# Altium schematic sheet Processor-2.SchDoc
size A3; Organization: Altium Limited; Address1: L3, 12a Rodborough Rd; Address2: Frenchs Forest; Address3: NSW; Address4: Australia 2086
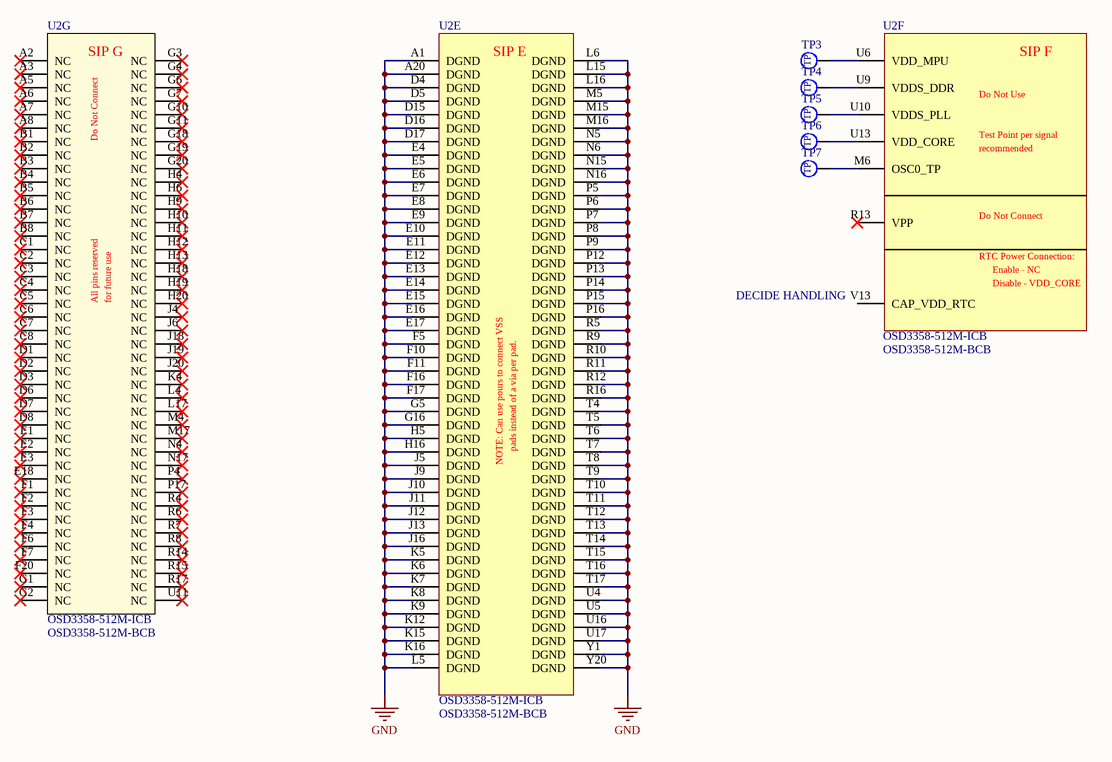
[diagram p0: Processor-2.SchDoc]

## Parts
TP3  2.5mm_SMD_TestPoint  [2.5mm TestPoint]  (value not drawn)
TP4  2.5mm_SMD_TestPoint  [2.5mm TestPoint]  (value not drawn)
TP5  2.5mm_SMD_TestPoint  [2.5mm TestPoint]  (value not drawn)
TP6  2.5mm_SMD_TestPoint  [2.5mm TestPoint]  (value not drawn)
TP7  2.5mm_SMD_TestPoint  [2.5mm TestPoint]  (value not drawn)
U2  OSD3358-512M-ICB  PartNumber: OSD3358-512M-BCB  [BGA_20x20_400_1p27mm]  (parts E,F,G of 7)

## Nets
GND: U2.A1(DGND) U2.A20(DGND) U2.D4(DGND) U2.D5(DGND) U2.D15(DGND) U2.D16(DGND) U2.D17(DGND) U2.E4(DGND) U2.E5(DGND) U2.E6(DGND) U2.E7(DGND) U2.E8(DGND) U2.E9(DGND) U2.E10(DGND) U2.E11(DGND) U2.E12(DGND) U2.E13(DGND) U2.E14(DGND) U2.E15(DGND) U2.E16(DGND) U2.E17(DGND) U2.F5(DGND) U2.F10(DGND) U2.F11(DGND) U2.F16(DGND) U2.F17(DGND) U2.G5(DGND) U2.G16(DGND) U2.H5(DGND) U2.H16(DGND) U2.J5(DGND) U2.J9(DGND) U2.J10(DGND) U2.J11(DGND) U2.J12(DGND) U2.J13(DGND) U2.J16(DGND) U2.K5(DGND) U2.K6(DGND) U2.K7(DGND) U2.K8(DGND) U2.K9(DGND) U2.K12(DGND) U2.K15(DGND) U2.K16(DGND) U2.L5(DGND) U2.L6(DGND) U2.L15(DGND) U2.L16(DGND) U2.M5(DGND) U2.M15(DGND) U2.M16(DGND) U2.N5(DGND) U2.N6(DGND) U2.N15(DGND) U2.N16(DGND) U2.P5(DGND) U2.P6(DGND) U2.P7(DGND) U2.P8(DGND) U2.P9(DGND) U2.P12(DGND) U2.P13(DGND) U2.P14(DGND) U2.P15(DGND) U2.P16(DGND) U2.R5(DGND) U2.R9(DGND) U2.R10(DGND) U2.R11(DGND) U2.R12(DGND) U2.R16(DGND) U2.T4(DGND) U2.T5(DGND) U2.T6(DGND) U2.T7(DGND) U2.T8(DGND) U2.T9(DGND) U2.T10(DGND) U2.T11(DGND) U2.T12(DGND) U2.T13(DGND) U2.T14(DGND) U2.T15(DGND) U2.T16(DGND) U2.T17(DGND) U2.U4(DGND) U2.U5(DGND) U2.U16(DGND) U2.U17(DGND) U2.Y1(DGND) U2.Y20(DGND)
NetTP3_1: TP3.1 U2.U6(VDD_MPU)
NetTP4_1: TP4.1 U2.U9(VDDS_DDR)
NetTP5_1: TP5.1 U2.U10(VDDS_PLL)
NetTP6_1: TP6.1 U2.U13(VDD_CORE)
NetTP7_1: TP7.1 U2.M6(OSC0_TP)

Not connected (* = marked no-connect by the designer): U2 A2(NC)* A3(NC)* A5(NC)* A6(NC)* A7(NC)* A8(NC)* B1(NC)* B2(NC)* B3(NC)* B4(NC)* B5(NC)* B6(NC)* B7(NC)* B8(NC)* C1(NC)* C2(NC)* C3(NC)* C4(NC)* C5(NC)* C6(NC)* C7(NC)* C8(NC)* D1(NC)* D2(NC)* D3(NC)* D6(NC)* D7(NC)* D8(NC)* E1(NC)* E2(NC)* E3(NC)* E18(NC)* F1(NC)* F2(NC)* F3(NC)* F4(NC)* F6(NC)* F7(NC)* F20(NC)* G1(NC)* G2(NC)* G3(NC)* G4(NC)* G6(NC)* G7(NC)* G10(NC)* G11(NC)* G18(NC)* G19(NC)* G20(NC)* H4(NC)* H6(NC)* H9(NC)* H10(NC)* H11(NC)* H12(NC)* H13(NC)* H18(NC)* H19(NC)* H20(NC)* J4(NC)* J6(NC)* J18(NC)* J19(NC)* J20(NC)* K4(NC)* L4(NC)* L17(NC)* M4(NC)* M17(NC)* N4(NC)* N17(NC)* P4(NC)* P17(NC)* R4(NC)* R6(NC)* R7(NC)* R8(NC)* R13(VPP)* R14(NC)* R15(NC)* R17(NC)* U11(NC)* V13(CAP_VDD_RTC)

## Notes on the sheet
- DECIDE HANDLING
- Title
- Size:
- Date:
- A3
- Number:
- Time:
- Revision:
- Sheet
- of
- File:
- (in symbol 2.5mm_SMD_TestPoint) TP
- (in symbol OSD3358-512M-ICB, part E) SIP E; pads instead of a via per pad.; NOTE: Can use pours to connect VSS
- (in symbol OSD3358-512M-ICB, part F) SIP F; Do Not Use; Test Point per signal; recommended; Do Not Connect; RTC Power Connection:; Enable - NC; Disable - VDD_CORE
- (in symbol OSD3358-512M-ICB, part G) SIP G; Do Not Connect; All pins reserved; for future use

## Library data of the parts
U2 = OSD3358-512M-ICB: Octavo Systems OSD335x Family SiP:  27mm x 27mm, 1.27mm pitch 400 pin BGA contains AM3358, 512MB DDR3, TPS65217C, TL5209, 4KB EEPROM, 4GB eMMC, 24MHz oscillator, and passives.  Industrial Temperature (case):  -40C to 85C.; PackageDescription: 400-Ball Grid Array, 21x21x2.6 mm, Pitch 1.27 mm; Package: FBGA; Pin Count: 400-ball; Mounting Technology: Surface Mount; Manufacturer: Octavo Systems; ComponentLinkURL: www.octavosystems.com; PackageReference: FBGA-400